# Altium schematic sheet POWER.SchDoc
size 246 x 182 mm
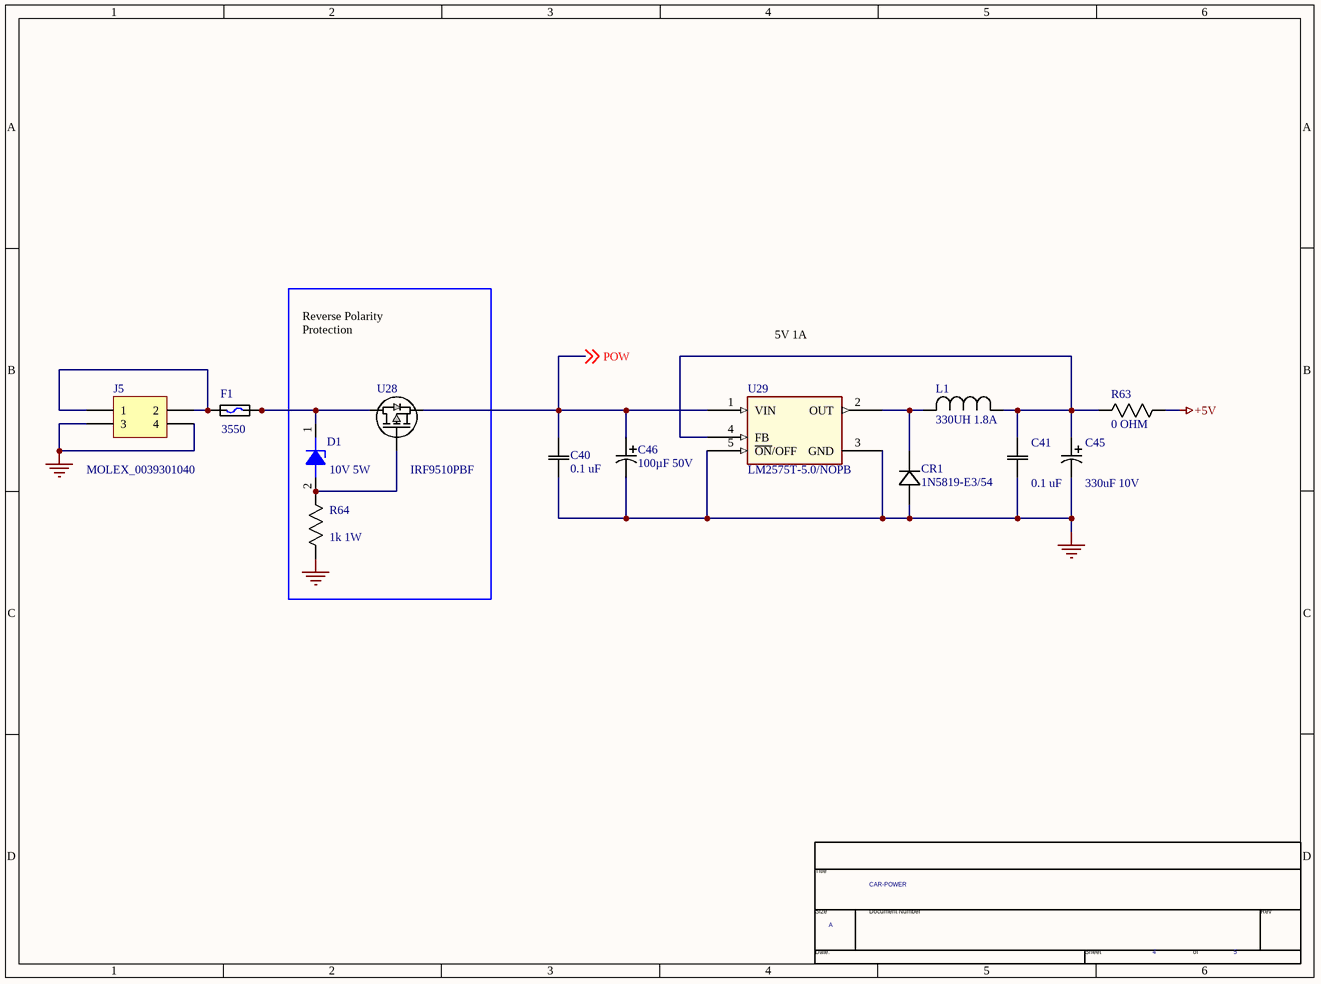
[diagram p0: POWER.SchDoc]

## Parts
*  Page Count: 5  Page Number: 4  Page Size: A  Title: CAR-POWER  (hidden comment: TitleBlock0)  (graphical)
C40  0.1 uF  [SR20]
C41  0.1 uF  [SR20]
C45  330uF 10V  [PCAP_63x112]
C46  100µF 50V  [PCAP_8x112]
CR1  1N5819-E3/54  [DO-204AL]
D1  10V 5W  [CASE_17AA-01]
F1  3550  [FUSE_CLIP_BLADE_HORIZONTAL]
J5  MOLEX_0039301040  [MOLEX_0039301040]
L1  330UH 1.8A  [AIUR-15]
R63  0 OHM  [RES AXIAL 1/6W]
R64  1k 1W  [YAG_FMP100]
U28  IRF9510PBF  [TO220HS]
U29  LM2575T-5.0/NOPB  [TO-220-5HS]

## Nets
+5V: R63.1
GND: C40.1 C41.1 C45.2 C46.2 CR1.2 J5.3 J5.4 R64.1 U29.3(GND) U29.5(~{ON}/OFF)
POW: C40.2 C46.1 U28.3(S) U29.1(VIN) ; off-sheet POW
NetC41_2: C41.2 C45.1 L1.1 R63.2 U29.4(FB)
NetCR1_1: CR1.1 L1.2 U29.2(OUT)
NetD1_1: D1.1(CATHODE) F1.2A F1.2B U28.2(D)
NetD1_2: D1.2(ANODE) R64.2 U28.1(G)
NetF1_1A: F1.1A F1.1B J5.1 J5.2

## Notes on the sheet
- Reverse Polarity
  Protection
- 5V 1A
- (in symbol TitleBlock0) Title; Size; Document Number; Rev; Date:; Sheet; of

## Library data of the parts
C40 C41 = CAP RADIAL 2.54: 0.1µF ±10% 100V Ceramic Capacitor X7R Radial; Manufacturer_Part_Number: C320C104K1R5TA7301; Vendor: KEMET; Type: DEV; RefDes: RefDes; Value: 0.1 uF
C45 = PCAP_63x112: CAP ALUM 330UF 20% 10V RADIAL; Manufacturer_Part_Number: ECA-1AM331; Vendor: Panasonic Electronic Components; Value: 330uF 10V
C46 = PCAP_8x112: CAP ALUM 100UF 20% 50V RADIAL; Manufacturer_Part_Number: ECA-1HM101; Vendor: Panasonic Electronic Components; Value: 100µF 50V
CR1 = 1N5819-E3/54: DIODE SCHOTTKY 40V 1A DO204AL; Vendor: Vishay; Built_By: EMA_UL_Team; Type: DEV; C: Copyright (C) 2015 Accelerated Designs. All rights reserved; Manufacturer_Part_Number: 1N5819-E3/54; RefDes: RefDes; Value: Value
D1 = 1N5347BRLG: DIODE ZENER 10V 5W AXIAL; Manufacturer_Part_Number: 1N5347BRLG; Value: 10V 5W
F1 = FUSE_CLIP_BLADE_HORIZONTAL: FUSE CLIP BLADE 500V 30A PCB; MF: Keystone Electronics; MP: 3550; Value: 3550
J5 = Header 2X2: Header, 2-Pin, Dual row; LatestRevisionDate: 17-Jul-2002; LatestRevisionNote: Re-released for DXP Platform.; Publisher: Altium Limited
L1 = AIUR-15-331K: FIXED IND 330UH 1.8A 260 MOHM TH; Manufacturer_Part_Number: AIUR-15-331K-ND; Vendor: Abracon; Built_By: EMA_UL_Team; Type: DEV; C: Copyright (C) 2015 Accelerated Designs. All rights reserved; RefDes: RefDes; Value: 330UH 1.8A
R63 = Resistor Axial  1/6W: RES 0 OHM 1/6W JUMP AXIAL; Manufacturer_Part_Number: ZOR-12-B-52-0R; Vendor: Yageo; RefDes: RefDes; Type: DEV; Value: 0 OHM
R64 = Resistor Axial  1W: RES 1K OHM 1W 5% AXIAL; Manufacturer_Part_Number: FMP100JR-52-1K; Vendor: Yageo; RefDes: RefDes; Type: DEV; Value: 1k 1W
U28 = IRF9510PBF: Imported; Vendor: Vishay; Built_By: EMA_UL_Team; C: Copyright (C) 2015 Accelerated Designs. All rights reserved; Manufacturer_Part_Number: IRF9510PBF; RefDes: RefDes; Type: DEV; Value: Value
U29 = LM2575T-5.0/NOPB: IC REG BUCK 5V 1A TO220-5; Manufacturer_Part_Number: LM2575T-5.0/NOPB
* = TitleBlock0: Page Create Date: March  8, 1995